# Altium schematic sheet NGUYEN LI .SchDoc
size A3; SheetNumber: 1; SheetTotal: 1
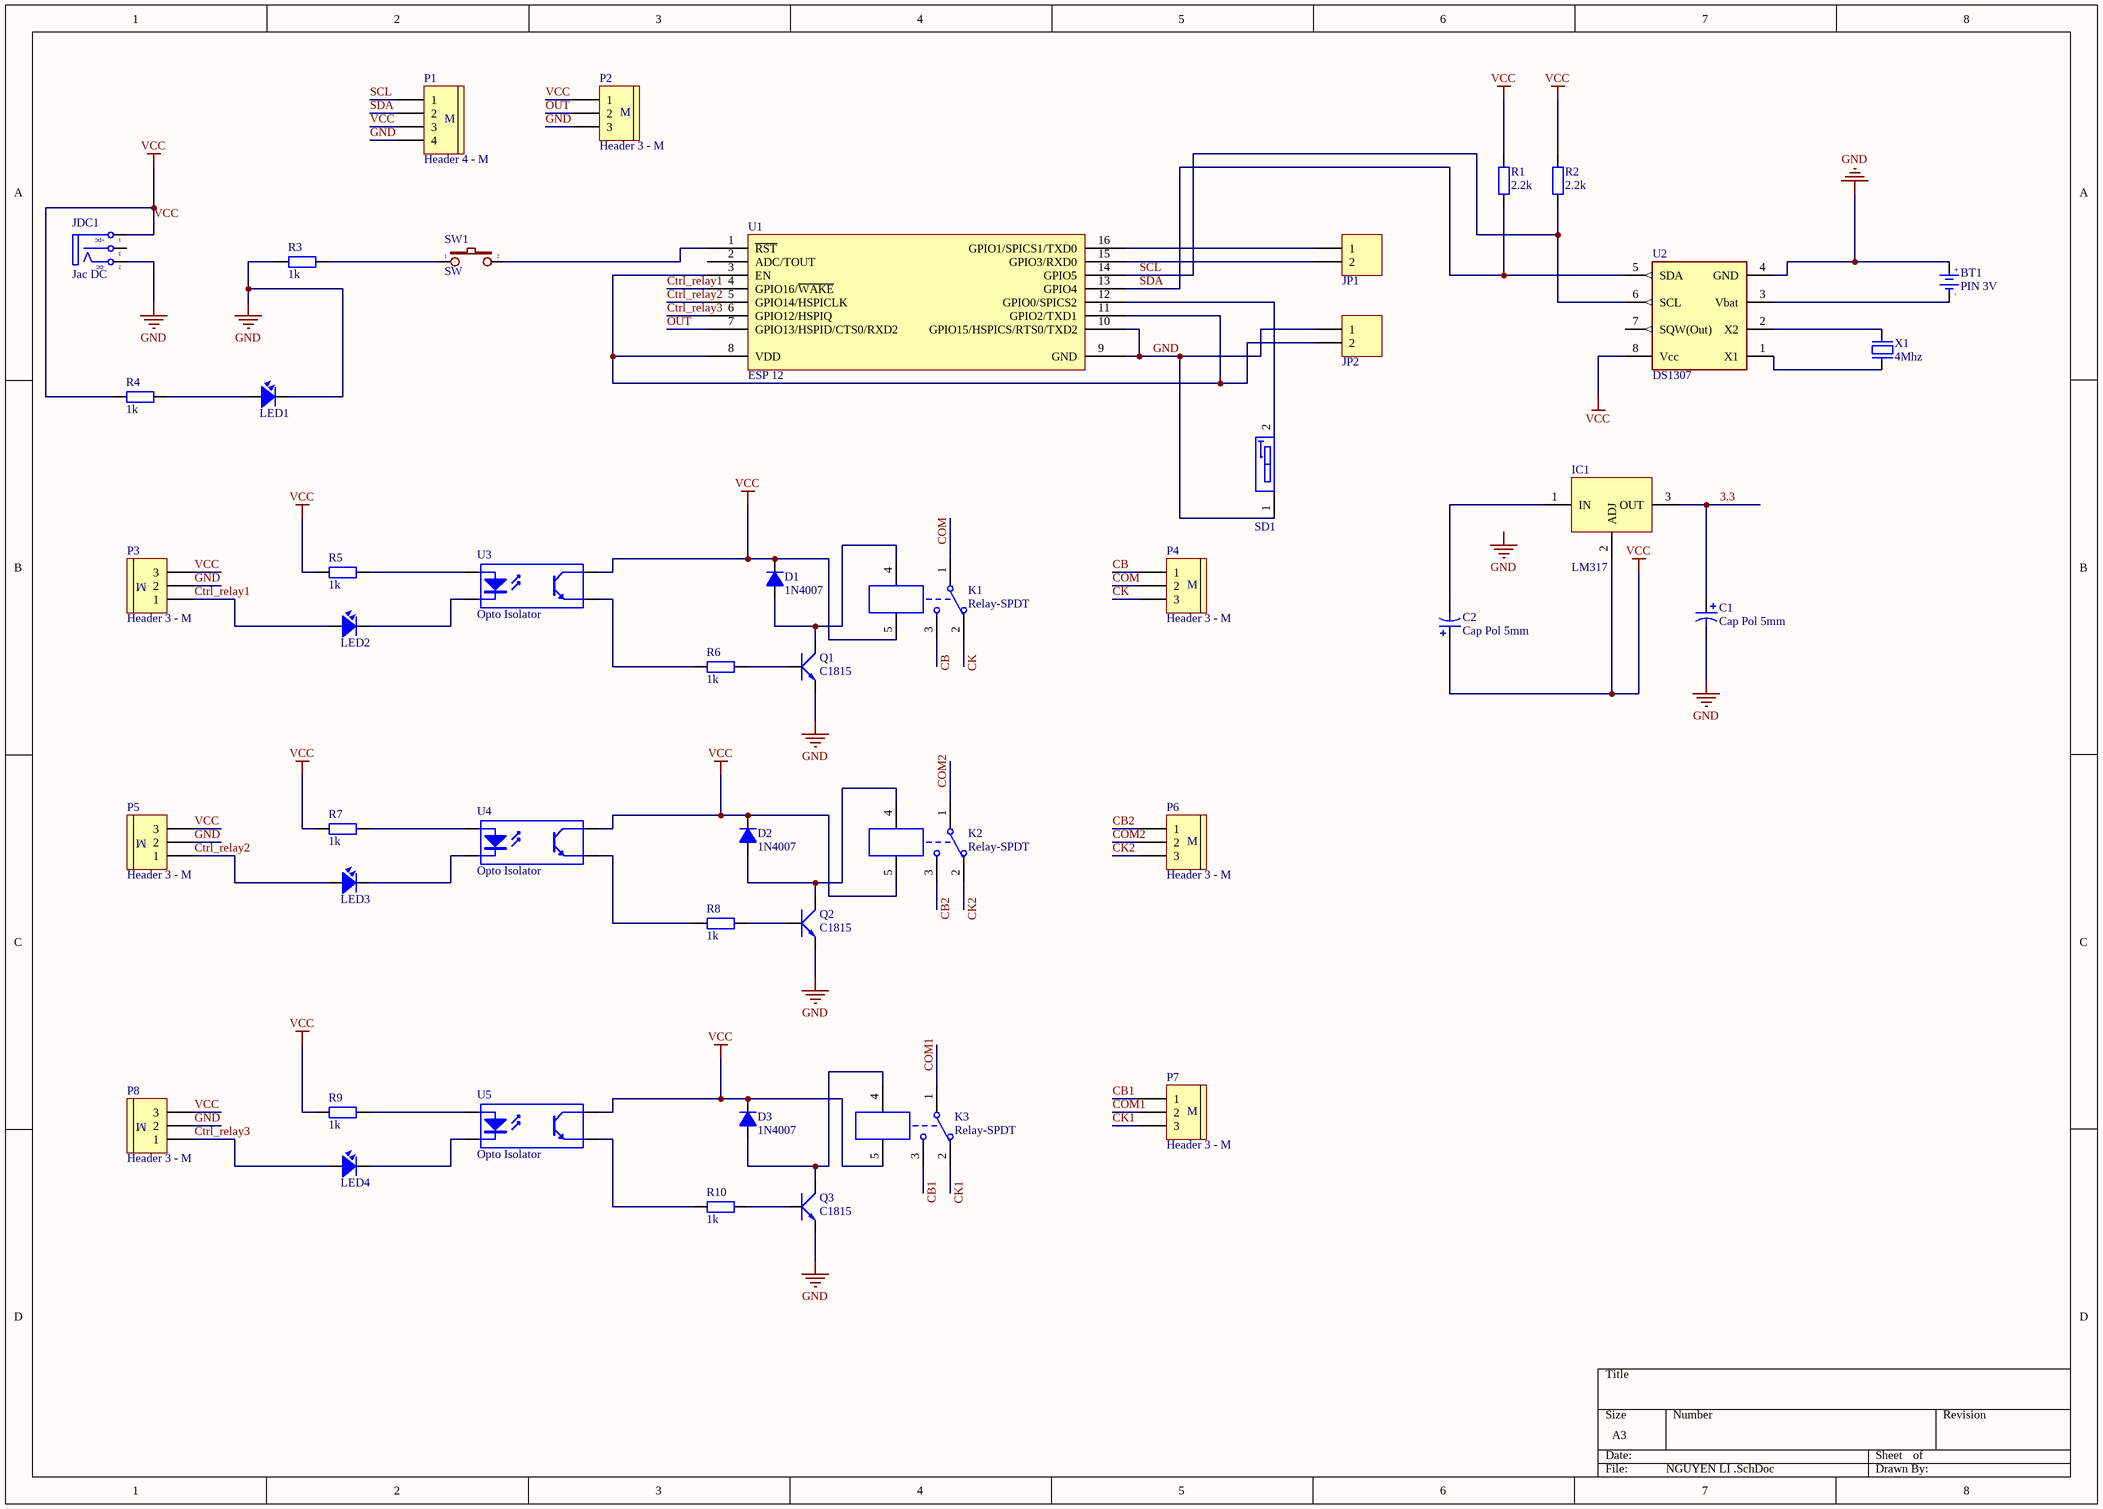
[diagram p0: NGUYEN LI .SchDoc]

## Parts
BT1  PIN 3V  [PIN3V]
C1  Cap Pol 5mm  [C5mm]
C2  Cap Pol 5mm  [C5mm]
D1  1N4007  [D2A]
D2  1N4007  [D2A]
D3  1N4007  [D2A]
IC1  LM317  [TO-220]
JDC1  Jac DC  [DC-IN]
JP1  Header 2_1  [HED2]  (value not drawn)
JP2  Header 2_1  [HED2]  (value not drawn)
K1  Relay-SPDT  [RELAY5PIN-10A]
K2  Relay-SPDT  [RELAY5PIN-10A]
K3  Relay-SPDT  [RELAY5PIN-10A]
LED1  LED  [LED-3]  (value not drawn)
LED2  LED  [LED-3]  (value not drawn)
LED3  LED  [LED-3]  (value not drawn)
LED4  LED  [LED-3]  (value not drawn)
P1  Header 4 - M  [Medium - Header 4]
P2  Header 3 - M  [Medium - Header 3]
P3  Header 3 - M  [Medium - Header 3]
P4  Header 3 - M  [Medium - Header 3]
P5  Header 3 - M  [Medium - Header 3]
P6  Header 3 - M  [Medium - Header 3]
P7  Header 3 - M  [Medium - Header 3]
P8  Header 3 - M  [Medium - Header 3]
Q1  C1815  [QTO-92]
Q2  C1815  [QTO-92]
Q3  C1815  [QTO-92]
R1  2.2k  [R1/4W]
R2  2.2k  [R1/4W]
R3  1k  [R1/4W]
R4  1k  [R1/4W]
R5  1k  [R1/4W]
R6  1k  [R1/4W]
R7  1k  [R1/4W]
R8  1k  [R1/4W]
R9  1k  [R1/4W]
R10  1k  [R1/4W]
SD1  SW - DIP2  [DIP2/W0.3K]  (value not drawn)
SW1  SW  [BUTTON 2PIN TRON]
U1  ESP 12  [ESP12_small]
U2  DS1307  [DIP.100/8/W.300/L.400]
U3  Opto Isolator  [PhotoCoupler]
U4  Opto Isolator  [PhotoCoupler]
U5  Opto Isolator  [PhotoCoupler]
X1  4Mhz  [XT2]

## Nets
GND: BT1.1(+3V) C1.2 JDC1.2(TN) JP2.1 LED1.2 P1.4 P2.3 P3.2 P5.2 P8.2 Q1.1(E) Q2.1(E) Q3.1(E) R3.1 SD1.1(A1) U1.9(GND) U1.10(GPIO15/HSPICS/RTS0/TXD2) U2.4(GND)
VCC: C2.1 D1.2(K) D2.2(K) D3.2(K) IC1.2(ADJ) JDC1.1(T) K1.5 K2.5 K3.5 P1.3 P2.1 P3.3 P5.3 P8.3 R1.1 R2.2 R4.1 R5.1 R7.1 R9.1 U2.8(Vcc) U3.4(C) U4.4(C) U5.4(C)
3.3: C1.1 IC1.3(OUT)
CB: K1.3 P4.1
CB1: K3.3 P7.1
CB2: K2.3 P6.1
CK: K1.2 P4.3
CK1: K3.2 P7.3
CK2: K2.2 P6.3
COM: K1.1 P4.2
COM1: K3.1 P7.2
COM2: K2.1 P6.2
Ctrl_relay1: LED2.1 P3.1 U1.4(GPIO16/~{WAKE})
Ctrl_relay2: LED3.1 P5.1 U1.5(GPIO14/HSPICLK)
Ctrl_relay3: LED4.1 P8.1 U1.6(GPIO12/HSPIQ)
OUT: P2.2 U1.7(GPIO13/HSPID/CTS0/RXD2)
SCL: P1.1 R2.1 U1.14(GPIO5) U2.6(SCL)
SDA: P1.2 R1.2 U1.13(GPIO4) U2.5(SDA)
NetBT1_2: BT1.2(GND) U2.3(Vbat)
NetC2_2: C2.2 IC1.1(IN)
NetD1_1: D1.1(A) K1.4 Q1.2(C)
NetD2_1: D2.1(A) K2.4 Q2.2(C)
NetD3_1: D3.1(A) K3.4 Q3.2(C)
NetJP1_1: JP1.1 U1.16(GPIO1/SPICS1/TXD0)
NetJP1_2: JP1.2 U1.15(GPIO3/RXD0)
NetJP2_2: JP2.2 U1.3(EN) U1.8(VDD) U1.11(GPIO2/TXD1)
NetLED1_1: LED1.1 R4.2
NetLED2_2: LED2.2 U3.2(K)
NetLED3_2: LED3.2 U4.2(K)
NetLED4_2: LED4.2 U5.2(K)
NetQ1_3: Q1.3(B) R6.2
NetQ2_3: Q2.3(B) R8.2
NetQ3_3: Q3.3(B) R10.2
NetR3_2: R3.2 SW1.1
NetR5_2: R5.2 U3.1(A)
NetR6_1: R6.1 U3.3(E)
NetR7_2: R7.2 U4.1(A)
NetR8_1: R8.1 U4.3(E)
NetR9_2: R9.2 U5.1(A)
NetR10_1: R10.1 U5.3(E)
NetSD1_2: SD1.2(A2) U1.12(GPIO0/SPICS2)
NetSW1_2: SW1.2 U1.1(~{RST})
NetU2_1: U2.1(X1) X1.1
NetU2_2: U2.2(X2) X1.2

Not connected (* = marked no-connect by the designer): JDC1 3(S); U1 2(ADC/TOUT); U2 7(SQW(Out))

## Notes on the sheet
- Labels drawn without touching a wire or pin: GND
- (in symbol DCIN) +DC; -DC
- (in symbol Header 3 - M) M
- (in symbol Header 4 - M) M
- (in symbol PIN 3V) +; -

## Library data of the parts
BT1 = PIN 3V: Battery 3VDC; Value: PIN 3V
C1 C2 = Cap Pol 5mm: Polarized Capacitor (Axial); Published: 8-Jun-2000; LatestRevisionDate: 17-Jul-2002; LatestRevisionNote: Re-released for DXP Platform.; PackageReference: POLAR0.8; Publisher: Altium Limited
D1-D3 = D1A: Diode 1A; Value: 1N4007
IC1 = LM317_1: Contact Email: bien-nb@thanglongie.com; Creator: Nguyen Ba Bien
JDC1 = DCIN: Jac DC input; Value: Jac DC
JP1 JP2 = Header 2_1: Header, 2-Pin; Manufacturer: Generic Components; Class: Connector; Value: Header 2
K1-K3 = Relay-SPDT: Single-Pole Dual-Throw Relay; Published: 24-Mar-1999; LatestRevisionDate: 17-Jul-2002; LatestRevisionNote: Re-released for DXP Platform.; PackageReference: MODULE5B; Publisher: Altium Limited
LED1-LED4 = LED: LED Single colour Green and Red; Value: LED 3 ly Single Colour
P1 = Header 4 - M: Header, 3-Pin, Medium; LatestRevisionDate: 17-Jul-2002; LatestRevisionNote: Re-released for DXP Platform.; Publisher: Altium Limited
P2-P8 = Header 3 - M: Header, 3-Pin, Medium; LatestRevisionDate: 17-Jul-2002; LatestRevisionNote: Re-released for DXP Platform.; Publisher: Altium Limited
Q1-Q3 = C1815: NPN 600mW, ECB; Value: C1815
R1-R10 = R1/4W: Resistor 1/4W; Value: R1/4W - 1K
SD1 = SWDIP-1: DIP Switch, 2 Position, SPST; Value: SW - DIP2
SW1 = SW2: Switch button 2 pin; Value: SW chip 2 pin
U1 = ESP_12: ESP-12 Wi-Fi Module by AI-Thinker; IC: ESP8266-EX; Vendor: Ai-thinker
U2 = DS1307: 64 X 8 Serial Real-Time Clock
U3-U5 = Opto Isolator: 4-Pin Phototransistor Optocoupler; Published: 24-Mar-1999; LatestRevisionDate: 04-Mar-2005; LatestRevisionNote: Sch pins 3 & 4 Swapped.; DatasheetDocument: Nov-2003; PackageReference: DIP-4; Publisher: Altium Limited
X1 = XT2: Crystal For all Crystal 2pin.; Value: 4Mhz